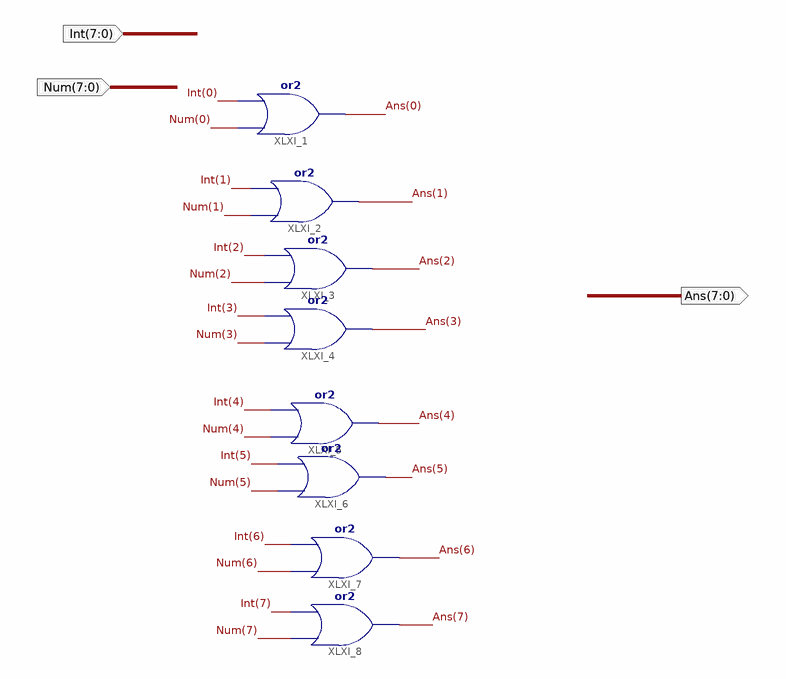
[diagram p0: schematic sheet 1]
// Xilinx ISE schematic Or16b2.sch (spartan3e) as structural Verilog: 8 symbols, 3 ports
module Or16b2 (
  input  [7:0] Int,
  input  [7:0] Num,
  output [7:0] Ans
);

  or XLXI_1 (Ans[0], Num[0], Int[0]);
  or XLXI_2 (Ans[1], Num[1], Int[1]);
  or XLXI_3 (Ans[2], Num[2], Int[2]);
  or XLXI_4 (Ans[3], Num[3], Int[3]);
  or XLXI_5 (Ans[4], Num[4], Int[4]);
  or XLXI_6 (Ans[5], Num[5], Int[5]);
  or XLXI_7 (Ans[6], Num[6], Int[6]);
  or XLXI_8 (Ans[7], Num[7], Int[7]);
endmodule
